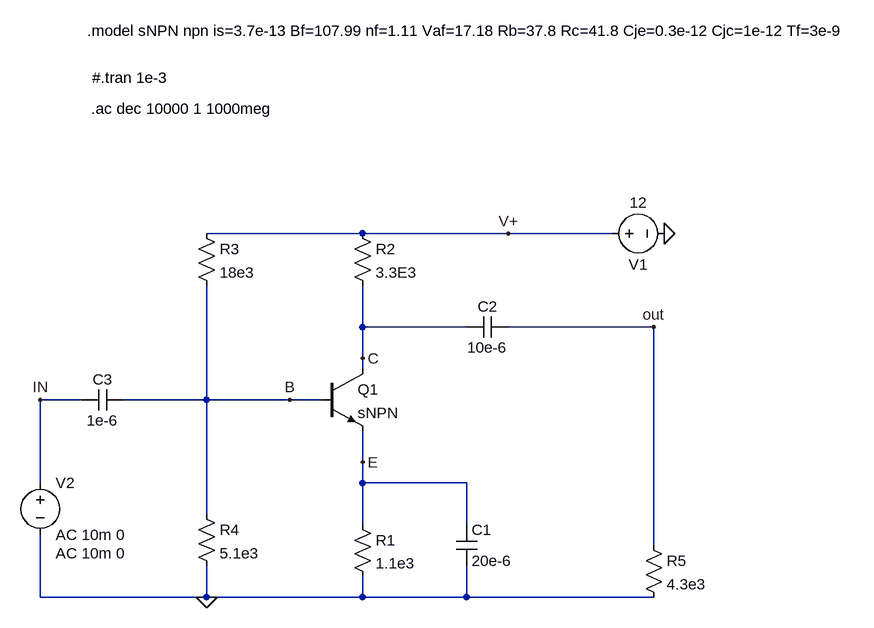
[diagram p0: schematic Draft1.asc]
Draft1.asc, the LTspice schematic file:
Version 4
SHEET 1 1168 680
WIRE 304 -80 64 -80
WIRE 528 -80 304 -80
WIRE 688 -80 528 -80
WIRE 304 64 304 0
WIRE 464 64 304 64
WIRE 752 64 528 64
WIRE 304 112 304 64
WIRE 304 128 304 112
WIRE -128 176 -192 176
WIRE 64 176 64 0
WIRE 64 176 -64 176
WIRE 192 176 64 176
WIRE 240 176 192 176
WIRE 304 272 304 224
WIRE -192 304 -192 176
WIRE 304 304 304 272
WIRE 464 304 304 304
WIRE 64 352 64 176
WIRE 304 368 304 304
WIRE 464 368 464 304
WIRE 752 400 752 64
WIRE -192 480 -192 384
WIRE 64 480 64 432
WIRE 64 480 -192 480
WIRE 304 480 304 448
WIRE 304 480 64 480
WIRE 464 480 464 432
WIRE 464 480 304 480
WIRE 752 480 464 480
FLAG 768 -80 0
FLAG 64 480 0
FLAG -192 176 IN
FLAG 752 64 out
FLAG 528 -80 V+
FLAG 192 176 B
FLAG 304 112 C
FLAG 304 272 E
SYMBOL npn 240 128 R0
SYMATTR InstName Q1
SYMATTR Value sNPN
SYMBOL res 288 352 R0
SYMATTR InstName R1
SYMATTR Value 1.1e3
SYMBOL res 288 -96 R0
SYMATTR InstName R2
SYMATTR Value 3.3E3
SYMBOL res 48 -96 R0
SYMATTR InstName R3
SYMATTR Value 18e3
SYMBOL res 48 336 R0
SYMATTR InstName R4
SYMATTR Value 5.1e3
SYMBOL res 736 384 R0
SYMATTR InstName R5
SYMATTR Value 4.3e3
SYMBOL cap 448 368 R0
SYMATTR InstName C1
SYMATTR Value 20e-6
SYMBOL cap 528 48 R90
WINDOW 0 0 32 VBottom 2
WINDOW 3 32 32 VTop 2
SYMATTR InstName C2
SYMATTR Value 10e-6
SYMBOL cap -64 160 R90
WINDOW 0 0 32 VBottom 2
WINDOW 3 32 32 VTop 2
SYMATTR InstName C3
SYMATTR Value 1e-6
SYMBOL voltage 672 -80 R270
WINDOW 0 -32 56 VBottom 2
WINDOW 3 32 56 VTop 2
WINDOW 123 0 0 Left 0
WINDOW 39 0 0 Left 0
SYMATTR InstName V1
SYMATTR Value 12
SYMBOL voltage -192 288 R0
WINDOW 123 24 124 Left 2
WINDOW 39 0 0 Left 0
SYMATTR Value2 AC 10m 0
SYMATTR InstName V2
SYMATTR Value AC 10m 0
TEXT -120 -392 Left 2 !.model sNPN npn is=3.7e-13 Bf=107.99 nf=1.11 Vaf=17.18 Rb=37.8 Rc=41.8 Cje=0.3e-12 Cjc=1e-12 Tf=3e-9
TEXT -112 -320 Left 2 !#.tran 1e-3
TEXT -114 -272 Left 2 !.ac dec 10000 1 1000meg

The netlist it stands for:
* Draft1.asc
Q1 C B E 0 sNPN
R1 E 0 1.1e3
R2 V+ C 3.3E3
R3 V+ B 18e3
R4 B 0 5.1e3
R5 out 0 4.3e3
C1 E 0 20e-6
C2 out C 10e-6
C3 B IN 1e-6
V1 V+ 0 12
V2 IN 0 AC 10m 0 AC 10m 0
.model NPN NPN
.model PNP PNP
.lib standard.bjt
.model sNPN npn is=3.7e-13 Bf=107.99 nf=1.11 Vaf=17.18 Rb=37.8 Rc=41.8 Cje=0.3e-12 Cjc=1e-12 Tf=3e-9
#.tran 1e-3
.ac dec 10000 1 1000meg
.backanno
.end